# EAGLE schematic CMoy-Pro-V_1_0_0_1 (EAGLE 6.4)

## Sheet 1 of 2
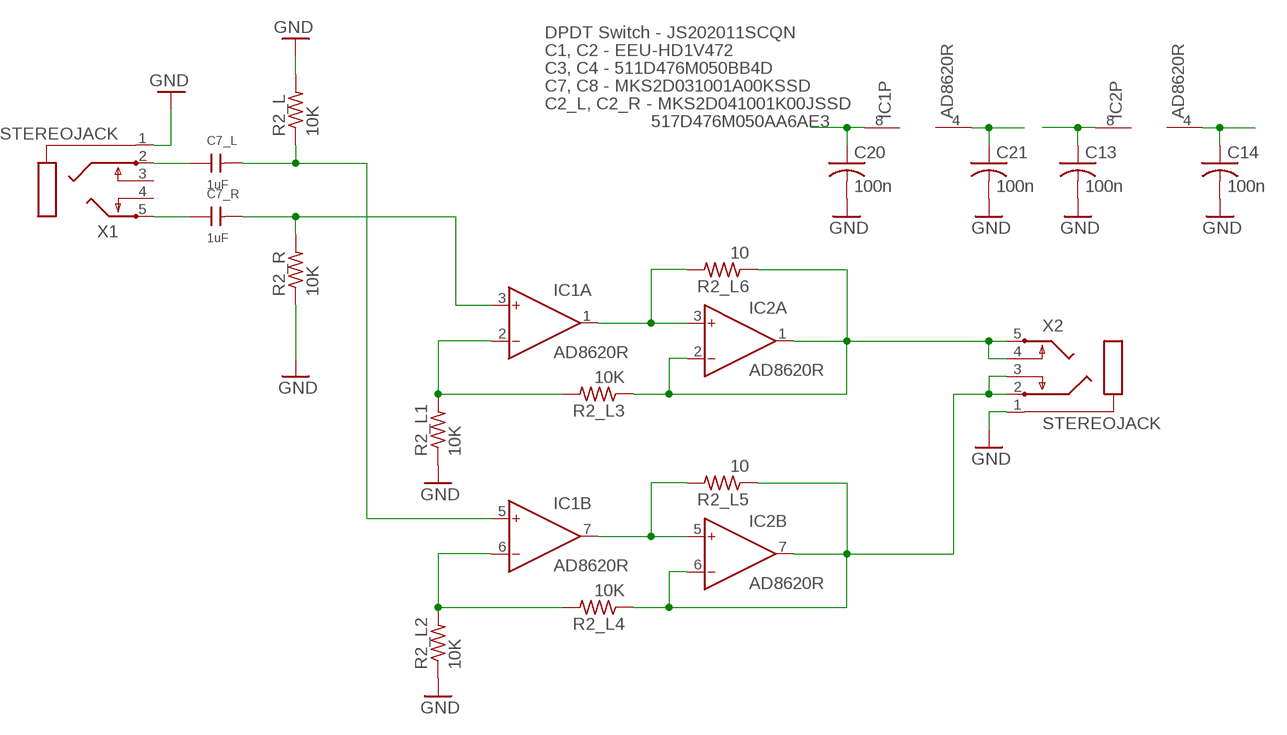
[diagram p0: schematic, sheet 1]

### Parts
C7_L  1uF  1,0NF100VMKS22  [2,5X5,5RM5,0]
C7_R  1uF  1,0NF100VMKS22  [2,5X5,5RM5,0]
C13  100n  C-USC0603  [C0603]
C14  100n  C-USC0603  [C0603]
C20  100n  C-USC0603  [C0603]
C21  100n  C-USC0603  [C0603]
IC1  AD8620R  [SO8]
IC2  AD8620R  [SO8]
R2_L  10K  R-US_0207/7  [0207/7]
R2_L1  10K  R-US_0207/7  [0207/7]
R2_L2  10K  R-US_0207/7  [0207/7]
R2_L3  10K  R-US_0207/7  [0207/7]
R2_L4  10K  R-US_0207/7  [0207/7]
R2_L5  10  R-US_0207/7  [0207/7]
R2_L6  10  R-US_0207/7  [0207/7]
R2_R  10K  R-US_0207/7  [0207/7]
X1  STEREOJACK  [STX3100]
X2  STEREOJACK  [STX3100]

### Nets
GND: C13.2 C14.2 C20.2 C21.2 R2_L1.1 R2_L2.1 R2_L.2 R2_R.1 X1.1 X2.1 ; also sheet 2
IN_R: C7_R.2 IC1.3(A:IN+) R2_R.2
N$1: C7_L.2 IC1.5(B:IN+) R2_L.1
N$4: C7_L.1 X1.2
N$5: IC2.1(A:OUT) IC2.2(A:IN-) R2_L3.1 R2_L6.1 X2.4 X2.5
N$6: IC1.2(A:IN-) R2_L1.2 R2_L3.2
N$7: C7_R.1 X1.5
N$12: IC1.6(B:IN-) R2_L2.2 R2_L4.2
N$19: IC1.1(A:OUT) IC2.3(A:IN+) R2_L6.2
N$20: IC1.7(B:OUT) IC2.5(B:IN+) R2_L5.2
N$21: IC2.6(B:IN-) IC2.7(B:OUT) R2_L4.1 R2_L5.1 X2.2 X2.3
V+: C13.1 C20.1 IC1.8(P:V+) IC2.8(P:V+) ; also sheet 2
V-: C14.1 C21.1 IC1.4(P:V-) IC2.4(P:V-) ; also sheet 2
Unconnected: X1.3 X1.4

### Notes on the sheet
- DPDT Switch - JS202011SCQN
- C1, C2 - EEU-HD1V472
- C3, C4 - 511D476M050BB4D
- C7, C8 - MKS2D031001A00KSSD
- C2_L, C2_R - MKS2D041001K00JSSD
- 517D476M050AA6AE3

## Sheet 2 of 2
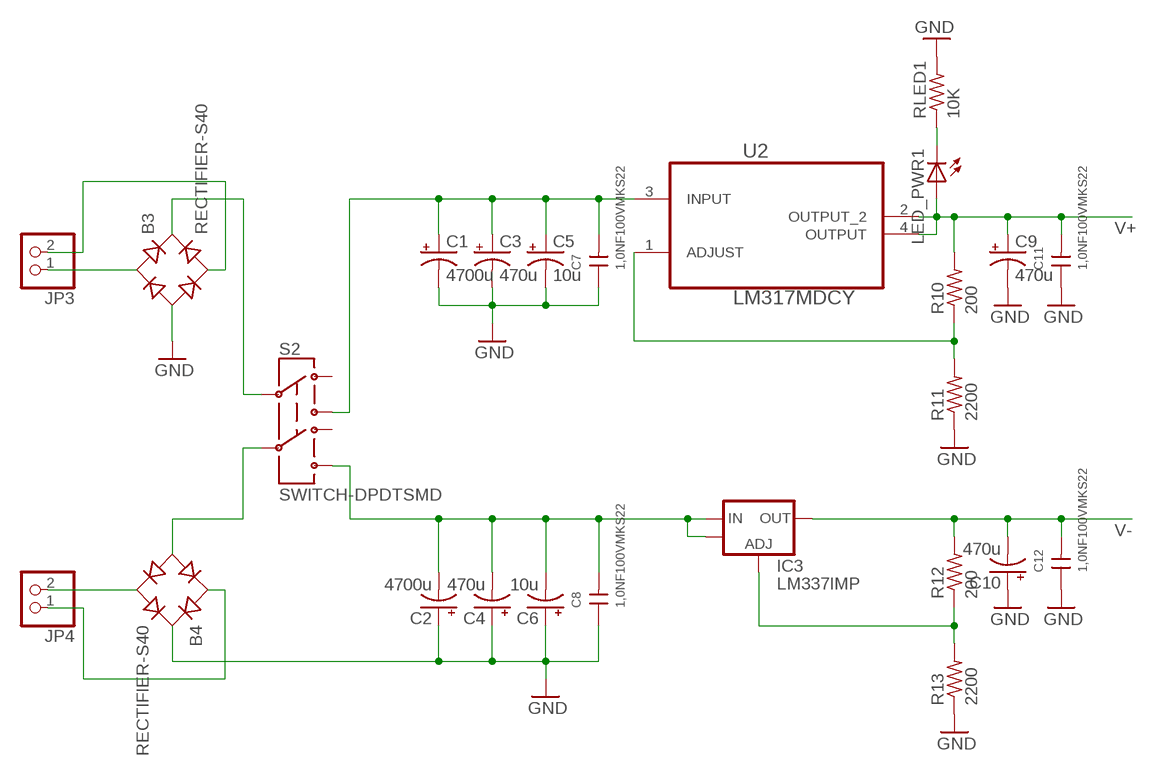
[diagram p1: schematic, sheet 2]

### Parts
B3  RECTIFIER-S40  [TO-269AA]
B4  RECTIFIER-S40  [TO-269AA]
C1  4700u  CPOL-USE7.5-16  [E7,5-16]
C2  4700u  CPOL-USE7.5-16  [E7,5-16]
C3  470u  CPOL-USE3.5-8  [E3,5-8]
C4  470u  CPOL-USE3.5-8  [E3,5-8]
C5  10u  CPOL-USE2-5  [E2-5]
C6  10u  CPOL-USE2-5  [E2-5]
C7  1,0NF100VMKS22  [2,5X5,5RM5,0]
C8  1,0NF100VMKS22  [2,5X5,5RM5,0]
C9  470u  CPOL-USE3.5-8  [E3,5-8]
C10  470u  CPOL-USE3.5-8  [E3,5-8]
C11  1,0NF100VMKS22  [2,5X5,5RM5,0]
C12  1,0NF100VMKS22  [2,5X5,5RM5,0]
IC3  LM337IMP  [SOT-223]
JP3  PINHD-1X2  [1X02]
JP4  PINHD-1X2  [1X02]
LED_PWR1  LEDCHIP-LED0603  [CHIP-LED0603]
R10  200  R-US_R0603  [R0603]
R11  2200  R-US_R0603  [R0603]
R12  200  R-US_R0603  [R0603]
R13  2200  R-US_R0603  [R0603]
RLED1  10K  R-US_R0603  [R0603]
S2  SWITCH-DPDTSMD  [AYZ0202]
U2  LM317MDCY  [SOT230P700X180-4N]

### Nets
GND: B3.- B4.+ C1.- C2.+ C3.- C4.+ C5.- C6.+ C7.1 C8.1 C9.- C10.+ C11.1 C12.1 R11.1 R13.1 RLED1.2 ; also sheet 1
N$2: LED_PWR1.C RLED1.1
N$3: IC3.1(ADJ) R12.1 R13.2
N$8: B3.+ S2.2
N$9: R10.1 R11.2 U2.1(ADJUST)
N$11: B4.- S2.5
N$13: B4.AC1 JP4.1
N$14: B3.AC2 JP3.2
N$15: C1.+ C3.+ C5.+ C7.2 S2.3 U2.3(INPUT)
N$16: B3.AC1 JP3.1
N$17: B4.AC2 JP4.2
N$18: C2.- C4.- C6.- C8.2 IC3.2(IN) IC3.4 S2.6
V+: C9.+ C11.2 LED_PWR1.A R10.2 U2.2(OUTPUT_2) U2.4(OUTPUT) ; also sheet 1
V-: C10.- C12.2 IC3.3(OUT) R12.2 ; also sheet 1
Unconnected: S2.1 S2.4

## Library data of the parts
B3 B4 = rectifier:RECTIFIER-: Rectifier
C1-C6 C9 C10 = rcl:CPOL-US: POLARIZED CAPACITOR, American symbol
C7 C7_L C7_R C8 C11 C12 = wima_c:1,0NF100V
C13 C14 C20 C21 = rcl:C-US: CAPACITOR, American symbol
IC1 IC2 = analog-devices:AD8620: Precision, Very Low Noise, Low Input Bias Current, Wide Bandwidth JFET Operational Amplifiers Source: http://www.analog.com/static/imported-files/data_sheets/AD8610_8620.pdf; MF: ALTERA CORPORATION; MPN: AD8620ARZ; OC_FARNELL: 9994386; OC_NEWARK: 59K6972
IC3 = AWJLEagleLib:LM337: LM337 adjustable negative voltage regulator
JP3 JP4 = pinhead:PINHD-1X2: PIN HEADER
LED_PWR1 = adafruit:LED: LED OSRAM: - CHIPLED LG R971, LG N971, LY N971, LG Q971, LY Q971, LO R971, LY R971 LH N974, LH R974 LS Q976, LO Q976, LY Q976 LO Q996 - Hyper CHIPLED LW Q18S LB Q993, LB Q99A, LB R99A - SideLED LS A670, LO A670, LY A670, LG A670, LP A670 LB A673, LV A673, LT A673, LW A673 LH A674 LY A675 LS A676, LA A676, LO A676, LY A676, LW A676 LS A679, LY A679, LG A679 - Hyper Micro SIDELED® LS Y876, LA Y876, LO Y876, LY Y876 LT Y87S - SmartLED LW L88C, LW L88S LB L89C, LB L89S, LG L890 LS L89K, LO L89K, LY L89K LS L896, LA L896, LO L896, LY L896 - TOPLED LS T670, LO T670, LY T670, LG T670, LP T670 LSG T670, LSP T670, LSY T670, LOP T670, LYG T670 LG T671, LOG T671, LSG T671 LB T673, LV T673, LT T673, LW T673 LH T674 LS T676, LA T676, LO T676, LY T676, LB T676, LH T676, LSB T676, LW T676 LB T67C, LV T67C, LT T67C, LS T67K, LO T67K, LY T67K, LW E67C LS E67B, LA E67B, LO E67B, LY E67B, LB E67C, LV E67C, LT E67C LW T67C LS T679, LY T679, LG T679 LS T770, LO T770, LY T770, LG T770, LP T770 LB T773, LV T773, LT T773, LW T773 LH T774 LS E675, LA E675, LY E675, LS T675 LS T776, LA T776, LO T776, LY T776, LB T776 LHGB T686 LT T68C, LB T68C - Hyper Mini TOPLED® LB M676 - Mini TOPLED Santana® LG M470 LS M47K, LO M47K, LY M47K Source: http://www.osram.convergy.de/
R2_L R2_L1-R2_L6 R2_R R10-R13 RLED1 = rcl:R-US_: RESISTOR, American symbol
S2 = SparkFun:SWITCH-DPDT: DPDT Version of the COM-00597
U2 = Texas Instruments_By_element14_Batch_1:LM317MDCY: IC ADJ LINEAR REG 1.25V TO 37V; MPN: LM317MDCY; OC_FARNELL: 1648658; OC_NEWARK: 75C0818; PACKAGE: SOT-223-3; SUPPLIER: TEXAS INSTRUMENTS
X1 X2 = adafruit:STEREOJACK: MIC/HEADPHONE JACK Stereo jack with two switches. Kycon STX3100, CUI SJ1-3555NG and/or 4UCon 05544